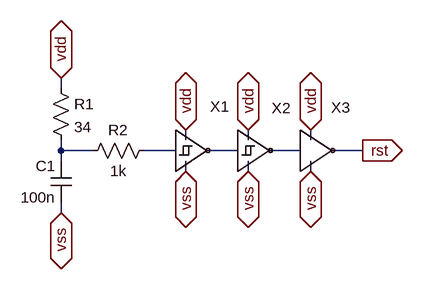
[diagram p0: schematic power_on_reset_circuit.asc]
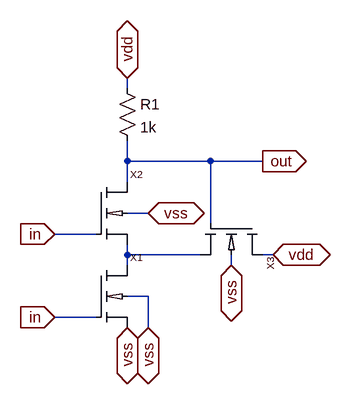
[diagram p1: sub-circuit schmitt_trigger_not.asc]
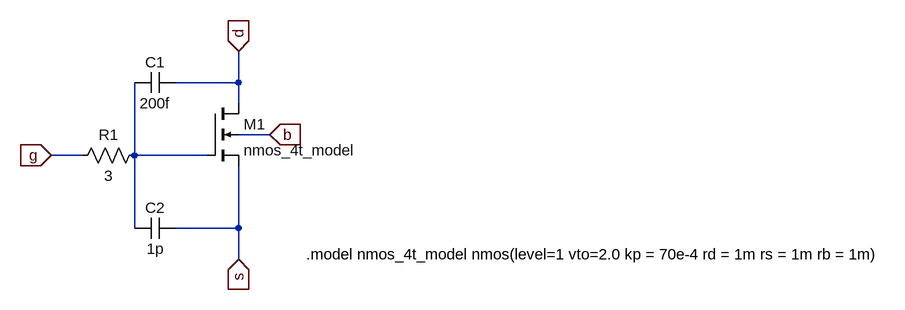
[diagram p2: sub-circuit nmos_4t.asc]
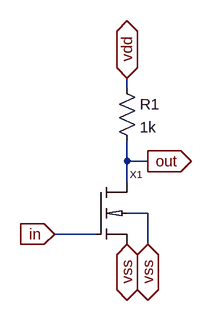
[diagram p3: sub-circuit not.asc]
power_on_reset_circuit.asc, the LTspice schematic file:
Version 4
SHEET 1 880 680
WIRE 128 128 128 112
WIRE 320 208 320 192
WIRE 416 208 416 192
WIRE 512 208 512 192
WIRE 128 224 128 208
WIRE 176 224 128 224
WIRE 304 224 256 224
WIRE 400 224 352 224
WIRE 496 224 448 224
WIRE 592 224 544 224
WIRE 128 240 128 224
WIRE 320 256 320 240
WIRE 416 256 416 240
WIRE 512 256 512 240
WIRE 128 320 128 304
FLAG 128 112 vdd
IOPIN 128 112 BiDir
FLAG 128 320 vss
IOPIN 128 320 BiDir
FLAG 320 256 vss
IOPIN 320 256 BiDir
FLAG 416 256 vss
IOPIN 416 256 BiDir
FLAG 320 192 vdd
IOPIN 320 192 BiDir
FLAG 512 256 vss
IOPIN 512 256 BiDir
FLAG 416 192 vdd
IOPIN 416 192 BiDir
FLAG 512 192 vdd
IOPIN 512 192 BiDir
FLAG 592 224 rst
IOPIN 592 224 Out
SYMBOL cap 144 304 R180
WINDOW 0 24 56 Left 2
WINDOW 3 24 8 Left 2
SYMATTR InstName C1
SYMATTR Value 100n
SYMBOL res 112 112 R0
SYMATTR InstName R1
SYMATTR Value 34
SYMBOL schmitt_trigger_not 304 224 R0
WINDOW 0 68 -52 Bottom 2
SYMATTR InstName X1
SYMBOL schmitt_trigger_not 400 224 R0
WINDOW 0 67 -50 Bottom 2
SYMATTR InstName X2
SYMBOL not 496 224 R0
WINDOW 0 62 -51 Bottom 2
SYMATTR InstName X3
SYMBOL res 160 240 R270
WINDOW 0 32 56 VTop 2
WINDOW 3 0 56 VBottom 2
SYMATTR InstName R2
SYMATTR Value 1k

schmitt_trigger_not.asc, the sub-circuit schematic file:
Version 4
SHEET 1 880 680
WIRE 176 -96 176 -112
WIRE 176 16 176 -16
WIRE 304 16 176 16
WIRE 384 16 304 16
WIRE 176 48 176 16
WIRE 208 96 176 96
WIRE 304 112 304 16
WIRE 128 128 64 128
WIRE 176 160 176 144
WIRE 288 160 176 160
WIRE 400 160 384 160
WIRE 176 176 176 160
WIRE 336 176 336 160
WIRE 208 224 176 224
WIRE 128 256 64 256
WIRE 208 272 208 224
FLAG 64 256 in
IOPIN 64 256 In
FLAG 176 272 vss
IOPIN 176 272 BiDir
FLAG 176 -112 vdd
IOPIN 176 -112 BiDir
FLAG 384 16 out
IOPIN 384 16 Out
FLAG 208 272 vss
IOPIN 208 272 BiDir
FLAG 208 96 vss
IOPIN 208 96 BiDir
FLAG 400 160 vdd
IOPIN 400 160 BiDir
FLAG 336 176 vss
IOPIN 336 176 BiDir
FLAG 64 128 in
IOPIN 64 128 In
SYMBOL res 160 -112 R0
SYMATTR InstName R1
SYMATTR Value 1k
SYMBOL nmos_4t 128 176 R0
SYMATTR InstName X1
SYMBOL nmos_4t 128 48 R0
SYMATTR InstName X2
SYMBOL nmos_4t 384 112 R90
SYMATTR InstName X3

nmos_4t.asc, the sub-circuit schematic file:
Version 4
SHEET 1 880 680
WIRE -288 -224 -288 -272
WIRE -288 -224 -384 -224
WIRE -288 -192 -288 -224
WIRE -240 -144 -288 -144
WIRE -528 -112 -576 -112
WIRE -448 -112 -448 -224
WIRE -336 -112 -448 -112
WIRE -448 0 -448 -112
WIRE -288 0 -288 -96
WIRE -288 0 -384 0
WIRE -288 48 -288 0
FLAG -576 -112 g
IOPIN -576 -112 In
FLAG -288 -272 d
IOPIN -288 -272 In
FLAG -288 48 s
IOPIN -288 48 In
FLAG -240 -144 b
IOPIN -240 -144 In
SYMBOL nmos4 -336 -192 R0
SYMATTR InstName M1
SYMATTR Value nmos_4t_model
SYMBOL cap -384 -240 R90
WINDOW 0 0 32 VBottom 2
WINDOW 3 32 32 VTop 2
SYMATTR InstName C1
SYMATTR Value 200f
SYMBOL cap -384 -16 R90
WINDOW 0 0 32 VBottom 2
WINDOW 3 32 32 VTop 2
SYMATTR InstName C2
SYMATTR Value 1p
SYMBOL res -432 -128 R90
WINDOW 0 0 56 VBottom 2
WINDOW 3 32 56 VTop 2
SYMATTR InstName R1
SYMATTR Value 3
TEXT -184 40 Left 2 !.model nmos_4t_model nmos(level=1 vto=2.0 kp = 70e-4 rd = 1m rs = 1m rb = 1m)

not.asc, the sub-circuit schematic file:
Version 4
SHEET 1 880 680
WIRE 176 -96 176 -112
WIRE 176 16 176 -16
WIRE 208 16 176 16
WIRE 176 48 176 16
WIRE 208 96 176 96
WIRE 128 128 64 128
WIRE 208 144 208 96
FLAG 64 128 in
IOPIN 64 128 In
FLAG 176 144 vss
IOPIN 176 144 BiDir
FLAG 176 -112 vdd
IOPIN 176 -112 BiDir
FLAG 208 16 out
IOPIN 208 16 Out
FLAG 208 144 vss
IOPIN 208 144 BiDir
SYMBOL res 160 -112 R0
SYMATTR InstName R1
SYMATTR Value 1k
SYMBOL nmos_4t 128 48 R0
SYMATTR InstName X1

The netlist it stands for:
* power_on_reset_circuit.asc
C1 vss N001 100n
R1 vdd N001 34
XX1 N002 N003 vss vdd schmitt_trigger_not
XX2 N003 N004 vss vdd schmitt_trigger_not
XX3 N004 rst vss vdd not
R2 N001 N002 1k

* block symbol definitions
.subckt schmitt_trigger_not in out vss vdd
R1 vdd out 1k
XX1 N001 in vss vss nmos_4t
XX2 out in N001 vss nmos_4t
XX3 vdd out N001 vss nmos_4t
.ends schmitt_trigger_not

.subckt nmos_4t D G S B
M1 d N001 s b nmos_4t_model
C1 d N001 200f
C2 s N001 1p
R1 N001 g 3
.model nmos_4t_model nmos(level=1 vto=2.0 kp = 70e-4 rd = 1m rs = 1m rb = 1m)
.ends nmos_4t

.subckt not in out vss vdd
R1 vdd out 1k
XX1 out in vss vss nmos_4t
.ends not

.model NMOS NMOS
.model PMOS PMOS
.lib standard.mos
.backanno
.end